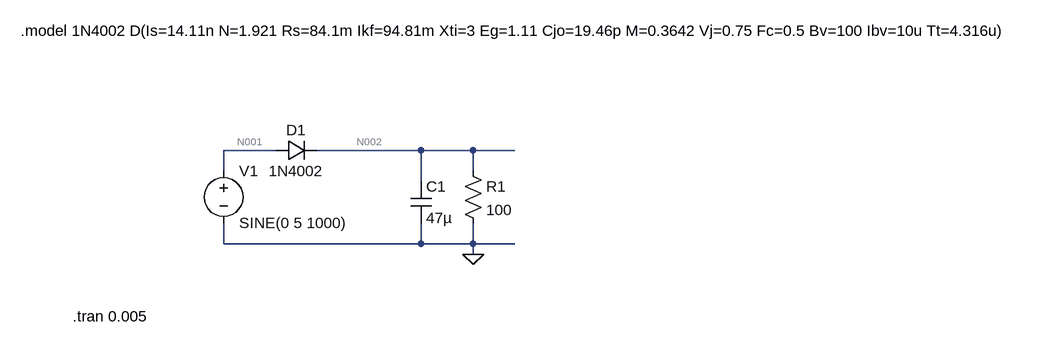
[diagram p0: schematic PeakRectifier.asc]
PeakRectifier.asc, the LTspice schematic file:
Version 4.1
SHEET 1 1496 680
WIRE 192 80 112 80
WIRE 416 80 256 80
WIRE 496 80 416 80
WIRE 560 80 496 80
WIRE 112 112 112 80
WIRE 496 112 496 80
WIRE 416 128 416 80
WIRE 112 224 112 192
WIRE 416 224 416 192
WIRE 416 224 112 224
WIRE 496 224 496 192
WIRE 496 224 416 224
WIRE 560 224 496 224
WIRE 496 240 496 224
FLAG 496 240 0
SYMBOL voltage 112 96 R0
WINDOW 123 0 0 Left 0
WINDOW 39 0 0 Left 0
SYMATTR InstName V1
SYMATTR Value SINE(0 5 1000)
SYMBOL diode 192 96 R270
WINDOW 0 32 32 VTop 2
WINDOW 3 0 32 VBottom 2
SYMATTR InstName D1
SYMATTR Value 1N4002
SYMBOL res 480 96 R0
SYMATTR InstName R1
SYMATTR Value 100
SYMBOL cap 400 128 R0
SYMATTR InstName C1
SYMATTR Value 47µ
TEXT -200 -104 Left 2 !.model 1N4002 D(Is=14.11n N=1.921 Rs=84.1m Ikf=94.81m Xti=3 Eg=1.11 Cjo=19.46p M=0.3642 Vj=0.75 Fc=0.5 Bv=100 Ibv=10u Tt=4.316u)
TEXT -120 336 Left 2 !.tran 0.005

The netlist it stands for:
* PeakRectifier.asc
V1 N001 0 SINE(0 5 1000)
D1 N001 N002 1N4002
R1 N002 0 100
C1 N002 0 47µ
.model D D
.lib standard.dio
.model 1N4002 D(Is=14.11n N=1.921 Rs=84.1m Ikf=94.81m Xti=3 Eg=1.11 Cjo=19.46p M=0.3642 Vj=0.75 Fc=0.5 Bv=100 Ibv=10u Tt=4.316u)
.tran 0.005
.backanno
.end

* Results of the author's LTspice run, read from the files saved beside the schematic
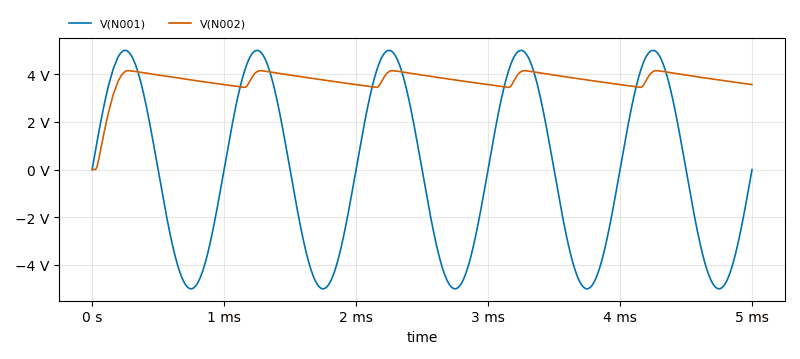
[diagram p1: Transient Analysis of PeakRectifier.asc, plotted from the saved traces]
* Transient Analysis, 1 run:
*   V(N001): min -5 V, max 5 V, average -366.6 µV, rms 3.535 V, last 0 V
*   V(N002): min 0 V, max 4.15 V, average 3.727 V, rms 3.764 V, last 3.564 V